# EasyEDA schematic SCH_Driver_Key_1.3-PCB_2026-01-25.json
TITLE: Sheet_1; REV: 1.0; Date: 2022-06-10; Sheet: 1/1; Company: Your Company
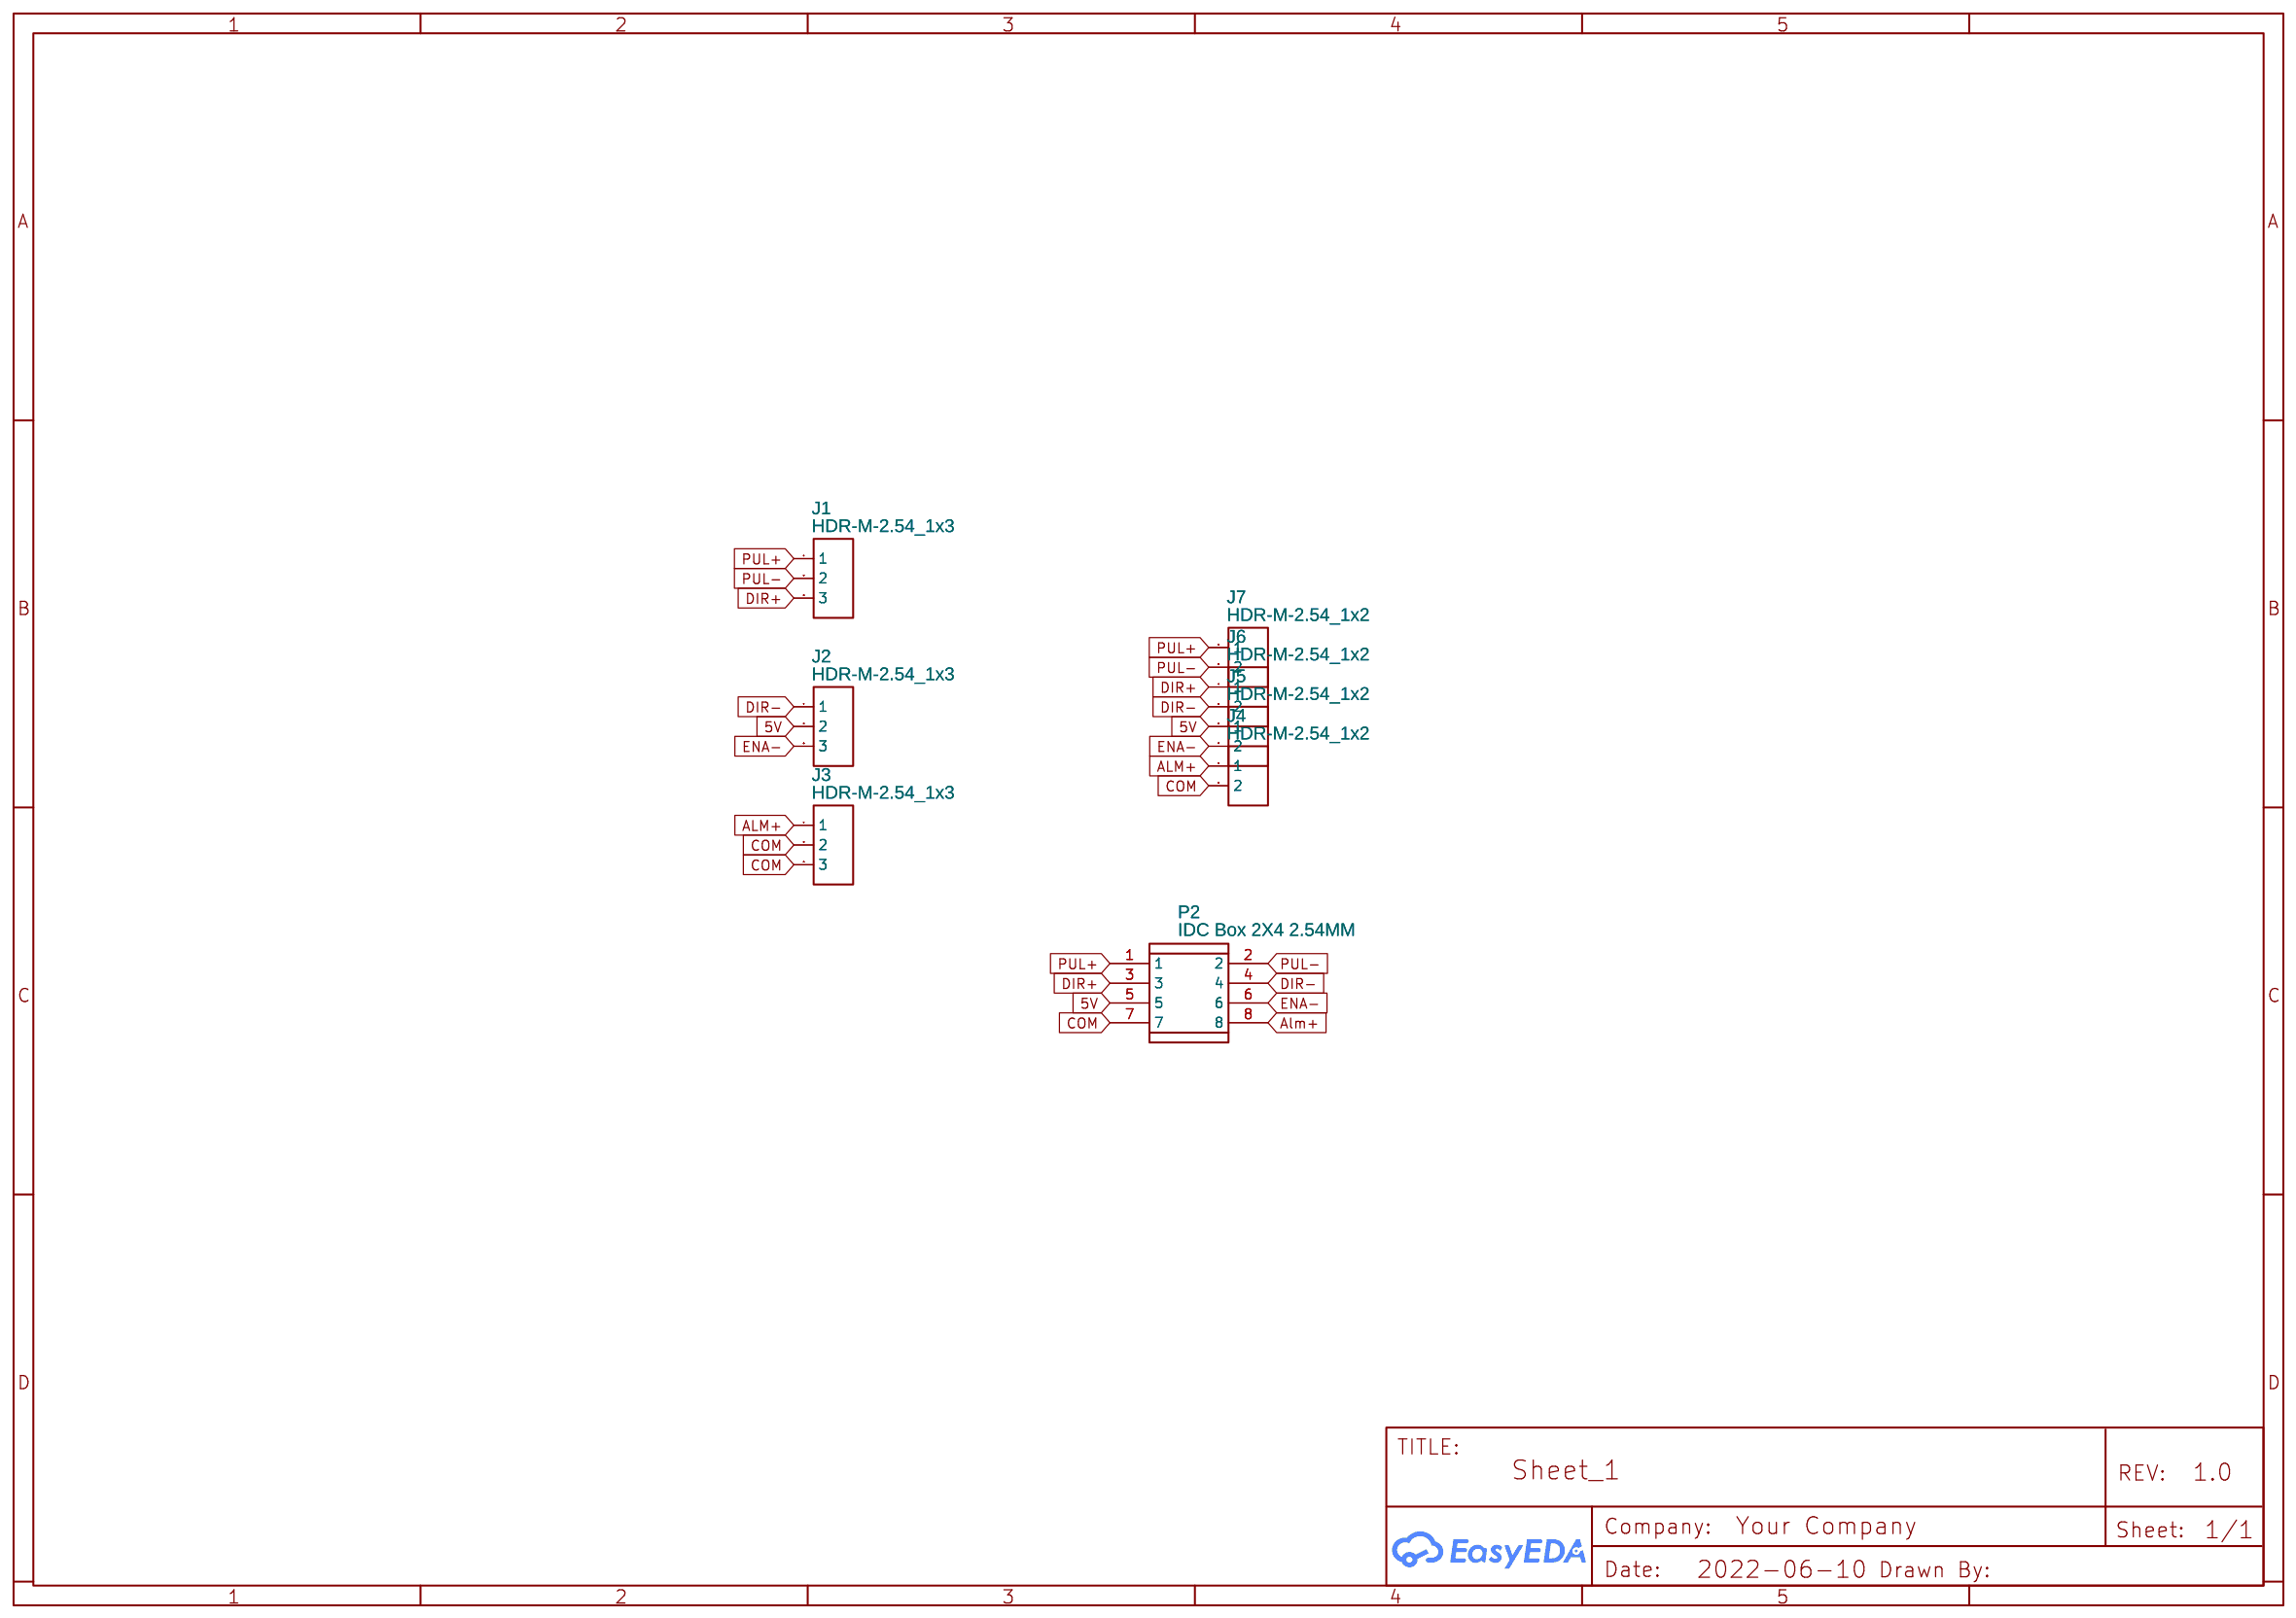
[diagram p0: schematic sheet]

## Parts
J1  HDR-M-2.54_1x3  [HDR-M-2.54_1X3]
J2  HDR-M-2.54_1x3  [HDR-M-2.54_1X3]
J3  HDR-M-2.54_1x3  [HDR-M-2.54_1X3]
J4  HDR-M-2.54_1x2  [HDR-M-2.54_1X2]
J5  HDR-M-2.54_1x2  [HDR-M-2.54_1X2]
J6  HDR-M-2.54_1x2  [HDR-M-2.54_1X2]
J7  HDR-M-2.54_1x2  [HDR-M-2.54_1X2]
P2  IDC Box 2X4 2.54MM  [IDC-TH_8P-P2.54-H-R2-C4-S2.54_1]

## Library data of the parts
J1-J3 = HDR-M-2.54_1x3: Supplier Part: C180248; Supplier: LCSC; Contributor: LCEDA_Lib
J4-J7 = HDR-M-2.54_1x2: Supplier Part: C124375; Supplier: LCSC; Contributor: LCEDA_Lib
P2 = IDC Box 2X4 2.54MM: Supplier: LCSC; Manufacturer: BOOMELE(博穆精密); Manufacturer Part: 2.54-2*4P弯简牛; Supplier Part: C9139; JLCPCB Part Class: Extended Part

## Nets
5V: J2.2 J5.1 P2.5
Alm+: P2.8
ALM+: J3.1 J4.1
COM: J3.2 J3.3 J4.2 P2.7
DIR+: J1.3 J6.1 P2.3
DIR-: J2.1 J6.2 P2.4
ENA-: J2.3 J5.2 P2.6
PUL+: J1.1 J7.1 P2.1
PUL-: J1.2 J7.2 P2.2
